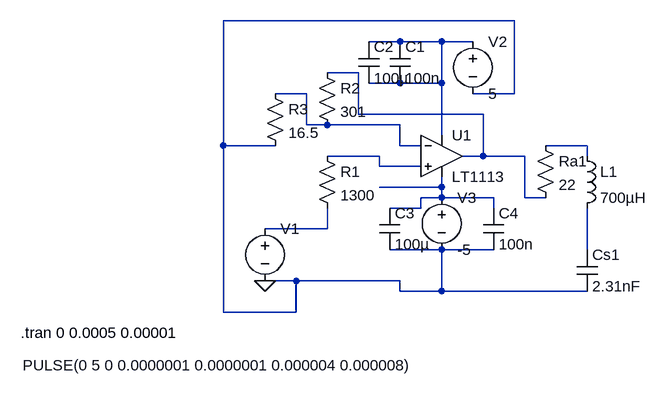
[diagram p0: schematic ResonantBuffer.asc]
ResonantBuffer.asc, the LTspice schematic file:
Version 4
SHEET 1 964 680
WIRE 576 -64 128 -64
WIRE 400 -32 352 -32
WIRE 464 -32 400 -32
WIRE 512 -32 464 -32
WIRE 336 16 288 16
WIRE 400 32 352 32
WIRE 464 32 464 -32
WIRE 464 32 400 32
WIRE 256 48 208 48
WIRE 576 48 576 -64
WIRE 576 48 512 48
WIRE 336 80 336 16
WIRE 528 80 336 80
WIRE 256 96 256 48
WIRE 288 96 256 96
WIRE 400 96 288 96
WIRE 464 112 464 32
WIRE 128 128 128 -64
WIRE 208 128 128 128
WIRE 400 128 400 96
WIRE 432 128 400 128
WIRE 688 128 624 128
WIRE 368 144 288 144
WIRE 528 144 528 80
WIRE 528 144 496 144
WIRE 592 144 528 144
WIRE 688 144 688 128
WIRE 368 160 368 144
WIRE 432 160 368 160
WIRE 464 192 464 176
WIRE 464 192 368 192
WIRE 464 208 464 192
WIRE 464 208 432 208
WIRE 544 208 464 208
WIRE 592 208 592 144
WIRE 624 208 592 208
WIRE 432 224 432 208
WIRE 432 224 384 224
WIRE 544 224 544 208
WIRE 288 256 288 224
WIRE 288 256 192 256
WIRE 464 288 384 288
WIRE 544 288 464 288
WIRE 688 288 688 224
WIRE 240 336 192 336
WIRE 400 336 240 336
WIRE 400 352 400 336
WIRE 464 352 464 288
WIRE 464 352 400 352
WIRE 688 352 464 352
WIRE 128 384 128 128
WIRE 240 384 240 336
WIRE 240 384 128 384
FLAG 192 336 0
SYMBOL res 272 128 R0
SYMATTR InstName R1
SYMATTR Value 1300
SYMBOL voltage 512 -48 R0
SYMATTR InstName V2
SYMATTR Value 5
SYMBOL ind 672 128 R0
SYMATTR InstName L1
SYMATTR Value 700µH
SYMATTR SpiceLine Rser=0.183
SYMBOL res 608 112 R0
SYMATTR InstName Ra1
SYMATTR Value 22
SYMBOL cap 672 288 R0
SYMATTR InstName Cs1
SYMATTR Value 2.31nF
SYMBOL voltage 192 240 R0
WINDOW 3 -373 226 Left 2
SYMATTR Value PULSE(0 5 0 0.0000001 0.0000001 0.000004 0.000008)
SYMATTR InstName V1
SYMBOL LT1113 464 80 R0
SYMATTR InstName U1
SYMBOL voltage 464 192 R0
SYMATTR InstName V3
SYMATTR Value -5
SYMBOL cap 384 -32 R0
SYMATTR InstName C1
SYMATTR Value 100n
SYMBOL cap 336 -32 R0
SYMATTR InstName C2
SYMATTR Value 100µ
SYMBOL cap 368 224 R0
SYMATTR InstName C3
SYMATTR Value 100µ
SYMBOL cap 528 224 R0
SYMATTR InstName C4
SYMATTR Value 100n
SYMBOL res 272 0 R0
SYMATTR InstName R2
SYMATTR Value 301
SYMBOL res 192 32 R0
SYMATTR InstName R3
SYMATTR Value 16.5
TEXT -184 416 Left 2 !.tran 0 0.0005 0.00001

The netlist it stands for:
* ResonantBuffer.asc
R1 N005 N007 1300
V2 N001 0 5
L1 N004 N008 700µH Rser=0.183
Ra1 N004 N002 22
Cs1 N008 0 2.31nF
V1 N007 0 PULSE(0 5 0 0.0000001 0.0000001 0.000004 0.000008)
* U1: LT1113 (symbol LT1113 not available, pins judged from their places): In+=N005 In-=N003 V+=N001 V-=N006 OUT=N002
V3 N006 0 -5
C1 N001 N001 100n
C2 N001 N001 100µ
C3 N006 0 100µ
C4 N006 0 100n
R2 N002 N003 301
R3 N003 0 16.5
.tran 0 0.0005 0.00001
.backanno
.end